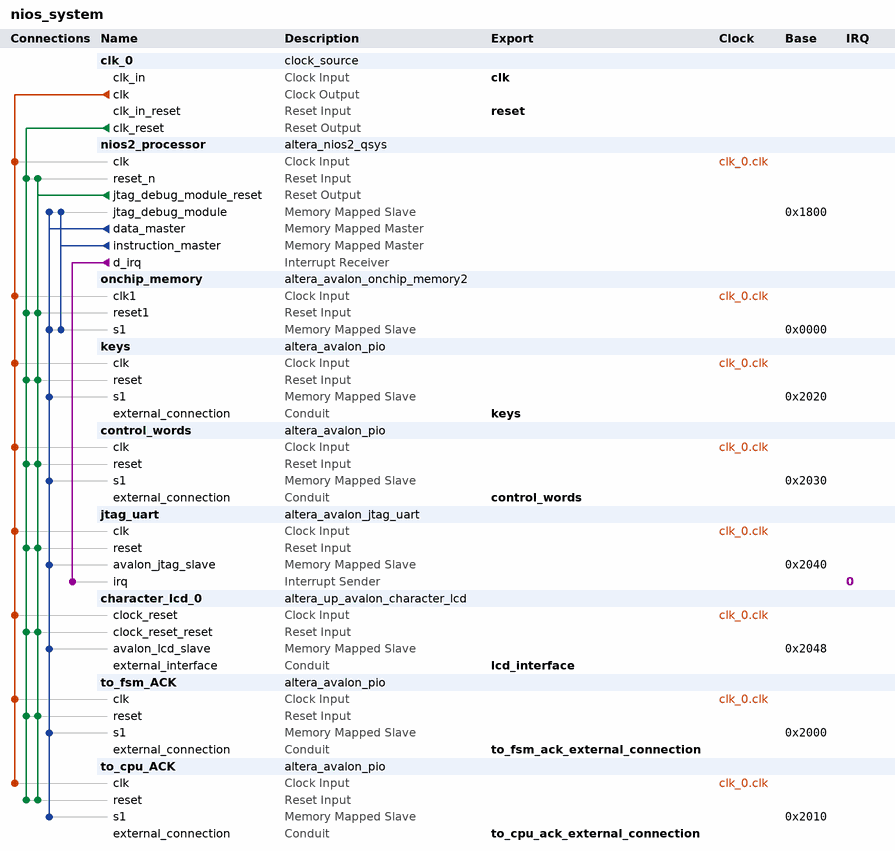
[diagram p0: system contents]
# Platform Designer (Qsys) system nios_system, Cyclone IV E EP4CE115F29C7
# Parameters at their usual value, and those the tool derives, are not listed.
package require -exact qsys 13.0.1.99.2
create_system nios_system
set_project_property DEVICE_FAMILY {Cyclone IV E}
set_project_property DEVICE EP4CE115F29C7

add_instance clk_0 clock_source 13.0
set_instance_parameter_value clk_0 clockFrequency 50000000

add_instance nios2_processor altera_nios2_qsys 13.0
set_instance_parameter_value nios2_processor resetSlave onchip_memory.s1
set_instance_parameter_value nios2_processor mmu_TLBMissExcSlave None
set_instance_parameter_value nios2_processor exceptionSlave onchip_memory.s1
set_instance_parameter_value nios2_processor breakSlave nios2_processor.jtag_debug_module
set_instance_parameter_value nios2_processor muldiv_multiplierType NoneSmall
set_instance_parameter_value nios2_processor impl Small
set_instance_parameter_value nios2_processor icache_size 4096

add_instance onchip_memory altera_avalon_onchip_memory2 13.0.1.99.2
set_instance_parameter_value onchip_memory dataWidth 32
set_instance_parameter_value onchip_memory dualPort false
set_instance_parameter_value onchip_memory initMemContent true
set_instance_parameter_value onchip_memory initializationFileName onchip_mem.hex
set_instance_parameter_value onchip_memory memorySize 4096

add_instance keys altera_avalon_pio 13.0.1.99.2
set_instance_parameter_value keys direction Input
set_instance_parameter_value keys width 3

add_instance control_words altera_avalon_pio 13.0.1.99.2
set_instance_parameter_value control_words direction Output
set_instance_parameter_value control_words width 8

add_instance jtag_uart altera_avalon_jtag_uart 13.0.1.99.2
set_instance_parameter_value jtag_uart simInteractiveOptions NO_INTERACTIVE_WINDOWS

add_instance character_lcd_0 altera_up_avalon_character_lcd 13.0
set_instance_parameter_value character_lcd_0 cursor Normal

add_instance to_fsm_ACK altera_avalon_pio 13.0.1.99.2
set_instance_parameter_value to_fsm_ACK direction Output
set_instance_parameter_value to_fsm_ACK width 1

add_instance to_cpu_ACK altera_avalon_pio 13.0.1.99.2
set_instance_parameter_value to_cpu_ACK direction Input
set_instance_parameter_value to_cpu_ACK width 1

# connections
add_connection clk_0.clk character_lcd_0.clock_reset clock
add_connection clk_0.clk control_words.clk clock
add_connection clk_0.clk jtag_uart.clk clock
add_connection clk_0.clk keys.clk clock
add_connection clk_0.clk nios2_processor.clk clock
add_connection clk_0.clk onchip_memory.clk1 clock
add_connection clk_0.clk to_cpu_ACK.clk clock
add_connection clk_0.clk to_fsm_ACK.clk clock
add_connection clk_0.clk_reset character_lcd_0.clock_reset_reset reset
add_connection clk_0.clk_reset control_words.reset reset
add_connection clk_0.clk_reset jtag_uart.reset reset
add_connection clk_0.clk_reset keys.reset reset
add_connection clk_0.clk_reset nios2_processor.reset_n reset
add_connection clk_0.clk_reset onchip_memory.reset1 reset
add_connection clk_0.clk_reset to_cpu_ACK.reset reset
add_connection clk_0.clk_reset to_fsm_ACK.reset reset
add_connection nios2_processor.jtag_debug_module_reset character_lcd_0.clock_reset_reset reset
add_connection nios2_processor.jtag_debug_module_reset control_words.reset reset
add_connection nios2_processor.jtag_debug_module_reset jtag_uart.reset reset
add_connection nios2_processor.jtag_debug_module_reset keys.reset reset
add_connection nios2_processor.jtag_debug_module_reset nios2_processor.reset_n reset
add_connection nios2_processor.jtag_debug_module_reset onchip_memory.reset1 reset
add_connection nios2_processor.jtag_debug_module_reset to_cpu_ACK.reset reset
add_connection nios2_processor.jtag_debug_module_reset to_fsm_ACK.reset reset
add_connection nios2_processor.data_master character_lcd_0.avalon_lcd_slave avalon
set_connection_parameter_value nios2_processor.data_master/character_lcd_0.avalon_lcd_slave baseAddress 0x2048
add_connection nios2_processor.data_master control_words.s1 avalon
set_connection_parameter_value nios2_processor.data_master/control_words.s1 baseAddress 0x2030
add_connection nios2_processor.data_master jtag_uart.avalon_jtag_slave avalon
set_connection_parameter_value nios2_processor.data_master/jtag_uart.avalon_jtag_slave baseAddress 0x2040
add_connection nios2_processor.data_master keys.s1 avalon
set_connection_parameter_value nios2_processor.data_master/keys.s1 baseAddress 0x2020
add_connection nios2_processor.data_master nios2_processor.jtag_debug_module avalon
set_connection_parameter_value nios2_processor.data_master/nios2_processor.jtag_debug_module baseAddress 0x1800
add_connection nios2_processor.data_master onchip_memory.s1 avalon
set_connection_parameter_value nios2_processor.data_master/onchip_memory.s1 baseAddress 0x0000
add_connection nios2_processor.data_master to_cpu_ACK.s1 avalon
set_connection_parameter_value nios2_processor.data_master/to_cpu_ACK.s1 baseAddress 0x2010
add_connection nios2_processor.data_master to_fsm_ACK.s1 avalon
set_connection_parameter_value nios2_processor.data_master/to_fsm_ACK.s1 baseAddress 0x2000
add_connection nios2_processor.instruction_master nios2_processor.jtag_debug_module avalon
set_connection_parameter_value nios2_processor.instruction_master/nios2_processor.jtag_debug_module baseAddress 0x1800
add_connection nios2_processor.instruction_master onchip_memory.s1 avalon
set_connection_parameter_value nios2_processor.instruction_master/onchip_memory.s1 baseAddress 0x0000
add_connection nios2_processor.d_irq jtag_uart.irq interrupt
set_connection_parameter_value nios2_processor.d_irq/jtag_uart.irq irqNumber 0

# exported interfaces
add_interface clk clock sink
set_interface_property clk EXPORT_OF clk_0.clk_in
add_interface reset reset sink
set_interface_property reset EXPORT_OF clk_0.clk_in_reset
add_interface control_words conduit end
set_interface_property control_words EXPORT_OF control_words.external_connection
add_interface keys conduit end
set_interface_property keys EXPORT_OF keys.external_connection
add_interface lcd_interface conduit end
set_interface_property lcd_interface EXPORT_OF character_lcd_0.external_interface
add_interface to_fsm_ack_external_connection conduit end
set_interface_property to_fsm_ack_external_connection EXPORT_OF to_fsm_ACK.external_connection
add_interface to_cpu_ack_external_connection conduit end
set_interface_property to_cpu_ack_external_connection EXPORT_OF to_cpu_ACK.external_connection

set_interconnect_requirement {$system} qsys_mm.clockCrossingAdapter HANDSHAKE
set_interconnect_requirement {$system} qsys_mm.maxAdditionalLatency 1

save_system nios_system.qsys
